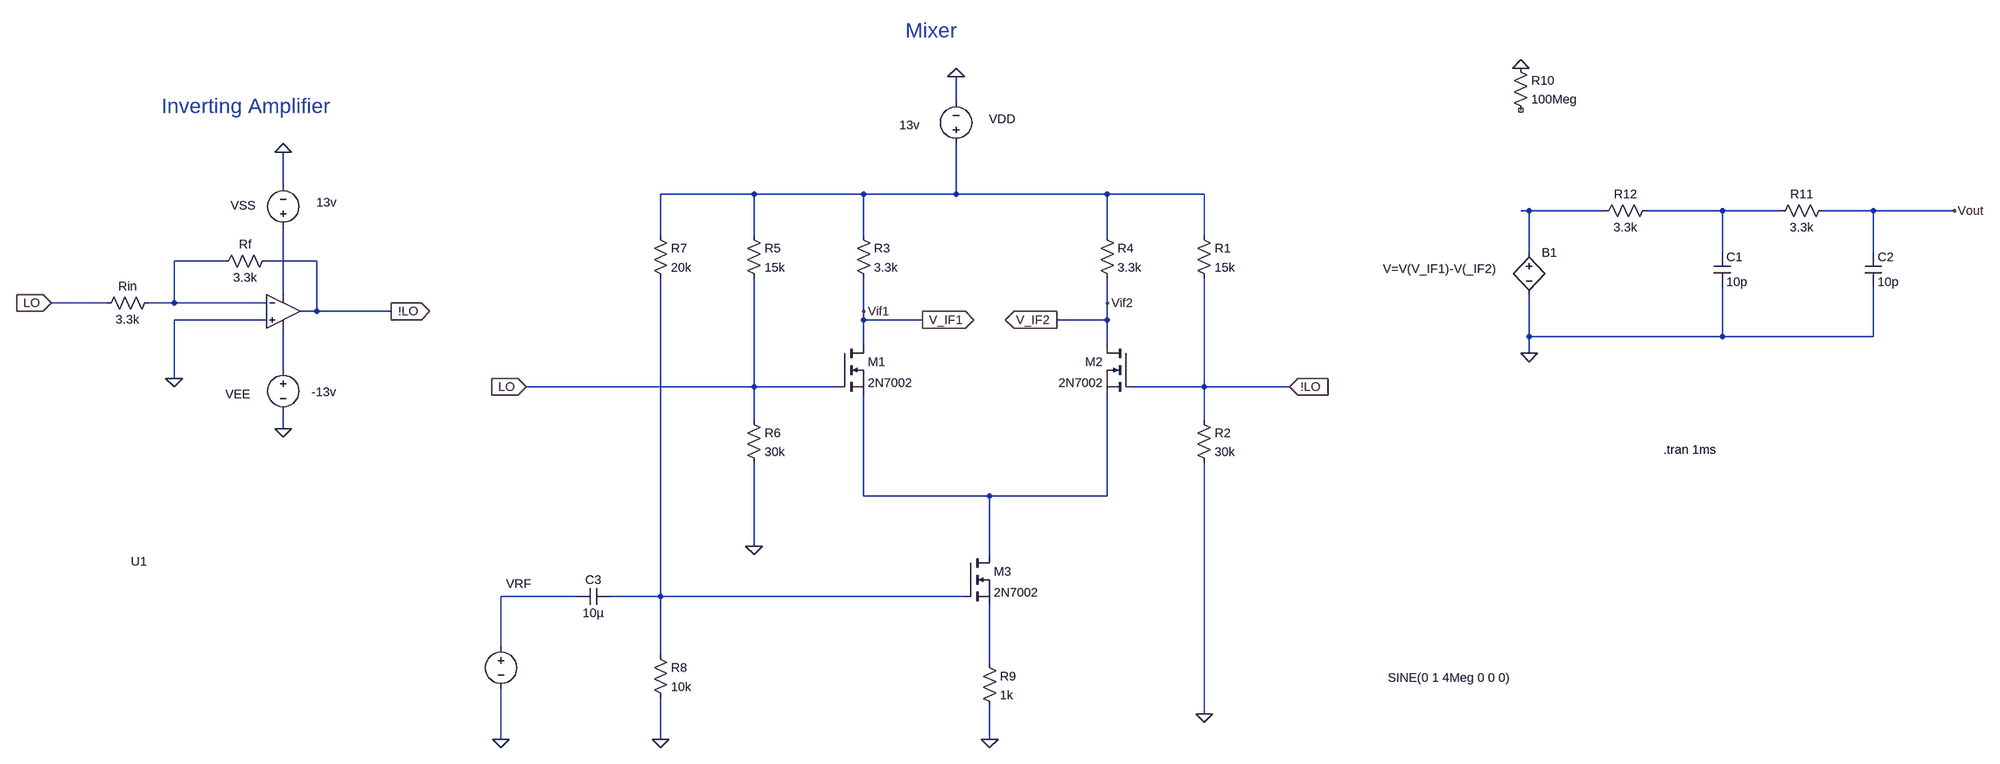
[diagram p0: schematic Mixer.asc]
Mixer.asc, the LTspice schematic file:
Version 4
SHEET 1 5004 2688
WIRE 1392 -400 1392 -448
WIRE -400 -240 -400 -304
WIRE 992 -224 784 -224
WIRE 1216 -224 992 -224
WIRE 1392 -224 1392 -320
WIRE 1392 -224 1216 -224
WIRE 1680 -224 1392 -224
WIRE 1888 -224 1680 -224
WIRE 3104 -192 3088 -192
WIRE 3248 -192 3104 -192
WIRE 3472 -192 3328 -192
WIRE 3584 -192 3472 -192
WIRE 3760 -192 3664 -192
WIRE 3936 -192 3760 -192
WIRE 784 -144 784 -224
WIRE 992 -144 992 -224
WIRE 1216 -144 1216 -224
WIRE 1680 -144 1680 -224
WIRE 1888 -144 1888 -224
WIRE 3104 -112 3104 -192
WIRE 3472 -112 3472 -192
WIRE 3760 -112 3760 -192
WIRE -512 -96 -608 -96
WIRE -336 -96 -432 -96
WIRE -400 -32 -400 -160
WIRE -736 -16 -880 -16
WIRE -608 -16 -608 -96
WIRE -608 -16 -656 -16
WIRE -432 -16 -608 -16
WIRE 1680 -16 1680 -64
WIRE -336 0 -336 -96
WIRE -336 0 -368 0
WIRE -144 0 -336 0
WIRE 1216 0 1216 -64
WIRE -432 16 -608 16
WIRE 1216 16 1216 0
WIRE 1328 16 1216 16
WIRE 1680 16 1680 -16
WIRE 1680 16 1584 16
WIRE 3104 48 3104 -32
WIRE 3472 48 3472 -48
WIRE 3472 48 3104 48
WIRE 3760 48 3760 -48
WIRE 3760 48 3472 48
WIRE 1216 64 1216 16
WIRE 1680 64 1680 16
WIRE 3104 80 3104 48
WIRE -400 112 -400 32
WIRE -608 128 -608 16
WIRE 992 144 992 -64
WIRE 992 144 528 144
WIRE 1168 144 992 144
WIRE 1888 144 1888 -64
WIRE 1888 144 1728 144
WIRE 2144 144 1888 144
WIRE 992 208 992 144
WIRE 1888 208 1888 144
WIRE -400 224 -400 192
WIRE 1216 352 1216 160
WIRE 1456 352 1216 352
WIRE 1680 352 1680 160
WIRE 1680 352 1456 352
WIRE 992 448 992 288
WIRE 1456 464 1456 352
WIRE 624 544 480 544
WIRE 784 544 784 -64
WIRE 784 544 688 544
WIRE 1408 544 784 544
WIRE 480 640 480 544
WIRE 784 656 784 544
WIRE 1456 672 1456 560
WIRE 1888 768 1888 288
WIRE 480 816 480 720
WIRE 784 816 784 736
WIRE 1456 816 1456 752
FLAG 1392 -448 0
FLAG 1456 816 0
FLAG 1888 768 0
FLAG 992 448 0
FLAG 784 816 0
FLAG 480 816 0
FLAG 1216 0 Vif1
FLAG 1680 -16 Vif2
FLAG 3104 80 0
FLAG 3936 -192 Vout
FLAG 3088 -464 0
FLAG 1328 16 V_IF1
IOPIN 1328 16 Out
FLAG 1584 16 V_IF2
IOPIN 1584 16 Out
FLAG -608 128 0
FLAG -144 0 !LO
IOPIN -144 0 Out
FLAG -880 -16 LO
IOPIN -880 -16 In
FLAG -400 -304 0
FLAG -400 224 0
FLAG 528 144 LO
IOPIN 528 144 In
FLAG 2144 144 !LO
IOPIN 2144 144 In
SYMBOL Res 1200 -160 R0
SYMATTR InstName R3
SYMATTR Value 3.3k
SYMBOL Res 1664 -160 R0
SYMATTR InstName R4
SYMATTR Value 3.3k
SYMBOL voltage 1392 -304 R180
WINDOW 0 -113 63 Left 2
WINDOW 3 69 51 Left 2
SYMATTR InstName VDD
SYMATTR Value 13v
SYMBOL nmos 1168 64 R0
SYMATTR InstName M1
SYMATTR Value 2N7002
SYMBOL nmos 1728 64 M0
SYMATTR InstName M2
SYMATTR Value 2N7002
SYMBOL nmos 1408 464 R0
SYMATTR InstName M3
SYMATTR Value 2N7002
SYMBOL Res 1872 -160 R0
SYMATTR InstName R1
SYMATTR Value 15k
SYMBOL Res 1872 192 R0
SYMATTR InstName R2
SYMATTR Value 30k
SYMBOL Res 976 -160 R0
SYMATTR InstName R5
SYMATTR Value 15k
SYMBOL Res 976 192 R0
SYMATTR InstName R6
SYMATTR Value 30k
SYMBOL voltage 480 624 R0
WINDOW 123 0 0 Left 0
WINDOW 39 0 0 Left 0
WINDOW 0 10 -104 Left 2
WINDOW 3 2355 75 Left 2
SYMATTR InstName VRF
SYMATTR Value SINE(0 1 4Meg 0 0 0)
SYMBOL Res 768 -160 R0
SYMATTR InstName R7
SYMATTR Value 20k
SYMBOL Res 768 640 R0
SYMATTR InstName R8
SYMATTR Value 10k
SYMBOL Cap 688 528 R90
WINDOW 0 0 32 VBottom 2
WINDOW 3 32 32 VTop 2
SYMATTR InstName C3
SYMATTR Value 10µ
SYMBOL Res 1440 656 R0
SYMATTR InstName R9
SYMATTR Value 1k
SYMBOL bv 3104 -128 R0
WINDOW 3 -278 47 Left 2
SYMATTR Value V=V(V_IF1)-V(_IF2)
SYMATTR InstName B1
SYMBOL res 3072 -480 R0
SYMATTR InstName R10
SYMATTR Value 100Meg
SYMBOL res 3680 -208 R90
WINDOW 0 0 56 VBottom 2
WINDOW 3 32 56 VTop 2
SYMATTR InstName R11
SYMATTR Value 3.3k
SYMBOL cap 3456 -112 R0
SYMATTR InstName C1
SYMATTR Value 10p
SYMBOL cap 3744 -112 R0
SYMATTR InstName C2
SYMATTR Value 10p
SYMBOL res 3344 -208 R90
WINDOW 0 0 56 VBottom 2
WINDOW 3 32 56 VTop 2
SYMATTR InstName R12
SYMATTR Value 3.3k
SYMBOL res -416 -112 R90
WINDOW 0 0 56 VBottom 2
WINDOW 3 32 56 VTop 2
SYMATTR InstName Rf
SYMATTR Value 3.3k
SYMBOL res -640 -32 R90
WINDOW 0 0 56 VBottom 2
WINDOW 3 32 56 VTop 2
SYMATTR InstName Rin
SYMATTR Value 3.3k
SYMBOL OpAmps\\UniversalOpamp2 -400 0 R0
WINDOW 0 -290 477 Left 2
SYMATTR InstName U1
SYMBOL voltage -400 96 R0
WINDOW 0 -110 62 Left 2
WINDOW 3 54 58 Left 2
WINDOW 123 0 0 Left 0
WINDOW 39 0 0 Left 0
SYMATTR InstName VEE
SYMATTR Value -13v
SYMBOL voltage -400 -144 R180
WINDOW 0 53 58 Left 2
WINDOW 3 -102 64 Left 2
WINDOW 123 0 0 Left 0
WINDOW 39 0 0 Left 0
SYMATTR InstName VSS
SYMATTR Value 13v
TEXT 3360 264 Left 2 !.tran 1ms
TEXT 1296 -536 Left 4 ;Mixer
TEXT -632 -392 Left 4 ;Inverting Amplifier

The netlist it stands for:
* Mixer.asc
R3 N001 V_IF1 3.3k
R4 N001 V_IF2 3.3k
VDD N001 0 13v
M1 V_IF1 LO N007 N007 2N7002
M2 V_IF2 !LO N007 N007 2N7002
M3 N007 N009 N010 N010 2N7002
R1 N001 !LO 15k
R2 !LO 0 30k
R5 N001 LO 15k
R6 LO 0 30k
VRF N008 0 SINE(0 1 4Meg 0 0 0)
R7 N001 N009 20k
R8 N009 0 10k
C3 N009 N008 10µ
R9 N010 0 1k
B1 N002 0 V=V(V_IF1)-V(_IF2)
R10 0 NC_01 100Meg
R11 Vout N003 3.3k
C1 N003 0 10p
C2 Vout 0 10p
R12 N003 N002 3.3k
Rf !LO N004 3.3k
Rin N004 LO 3.3k
XU1 0 N004 N005 N006 !LO level.2 Avol=1Meg GBW=10Meg Slew=10Meg ilimit=25m rail=0 Vos=0 phimargin=45 en=0 enk=0 in=0 ink=0 Rin=500Meg  ; pins IN+ IN- V+ V- OUT
VEE N006 0 -13v
VSS N005 0 13v
.model NMOS NMOS
.model PMOS PMOS
.lib standard.mos
.tran 1ms
* Mixer
* Inverting Amplifier
.lib UniversalOpamps2.sub
.backanno
.end